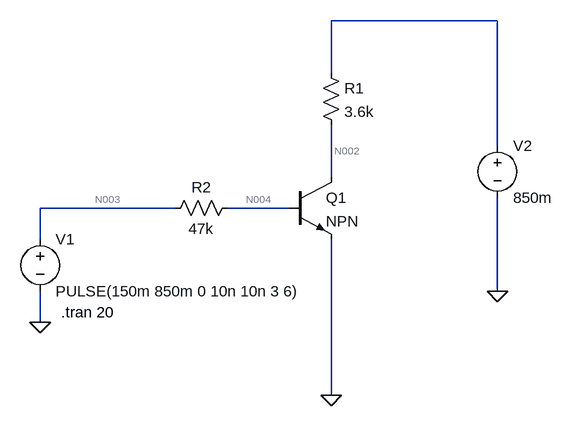
[diagram p0: schematic Draft1.asc]
Draft1.asc, the LTspice schematic file:
Version 4.1
SHEET 1 880 680
WIRE 544 -112 288 -112
WIRE 288 -32 288 -112
WIRE 544 80 544 -112
WIRE 288 128 288 48
WIRE 48 176 -160 176
WIRE 224 176 128 176
WIRE -160 224 -160 176
WIRE 544 304 544 160
WIRE -160 352 -160 304
WIRE 288 464 288 224
FLAG 288 464 0
FLAG -160 352 0
FLAG 544 304 0
SYMBOL npn 224 128 R0
SYMATTR InstName Q1
SYMBOL res 272 -48 R0
SYMATTR InstName R1
SYMATTR Value 3.6k
SYMBOL res 144 160 R90
WINDOW 0 0 56 VBottom 2
WINDOW 3 32 56 VTop 2
SYMATTR InstName R2
SYMATTR Value 47k
SYMBOL voltage -160 208 R0
WINDOW 123 0 0 Left 0
WINDOW 39 0 0 Left 0
SYMATTR InstName V1
SYMATTR Value PULSE(150m 850m 0 10n 10n 3 6)
SYMBOL voltage 544 64 R0
WINDOW 123 0 0 Left 0
WINDOW 39 0 0 Left 0
SYMATTR InstName V2
SYMATTR Value 850m
TEXT -128 336 Left 2 !.tran 20

The netlist it stands for:
* Draft1.asc
Q1 N002 N004 0 0 NPN
R1 N001 N002 3.6k
R2 N004 N003 47k
V1 N003 0 PULSE(150m 850m 0 10n 10n 3 6)
V2 N001 0 850m
.model NPN NPN
.model PNP PNP
.lib standard.bjt
.tran 20
.backanno
.end

* Results of the author's LTspice run, read from the files saved beside the schematic
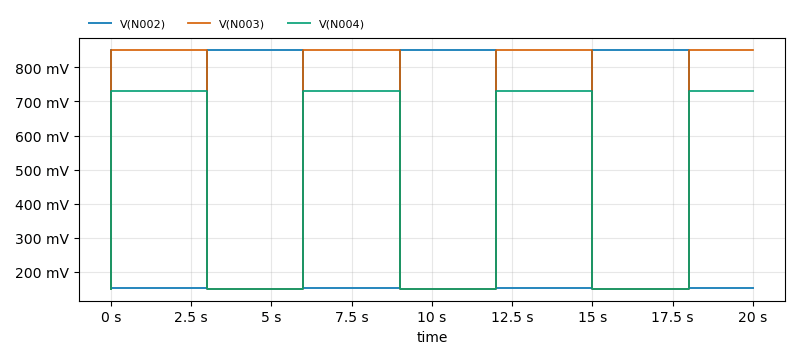
[diagram p1: Transient Analysis of Draft1.asc, plotted from the saved traces]
* Transient Analysis, 1 run:
*   V(N002): min 151.4 mV, max 850 mV, average 465.8 mV, rms 581.2 mV, last 151.4 mV
*   V(N003): min 150 mV, max 850 mV, average 535 mV, rms 638.4 mV, last 850 mV
*   V(N004): min 150 mV, max 732 mV, average 470.1 mV, rms 552.1 mV, last 732 mV